# Altium schematic sheet Project_OLIA.SchDoc
size A2; SheetNumber: 1; SheetTotal: 1
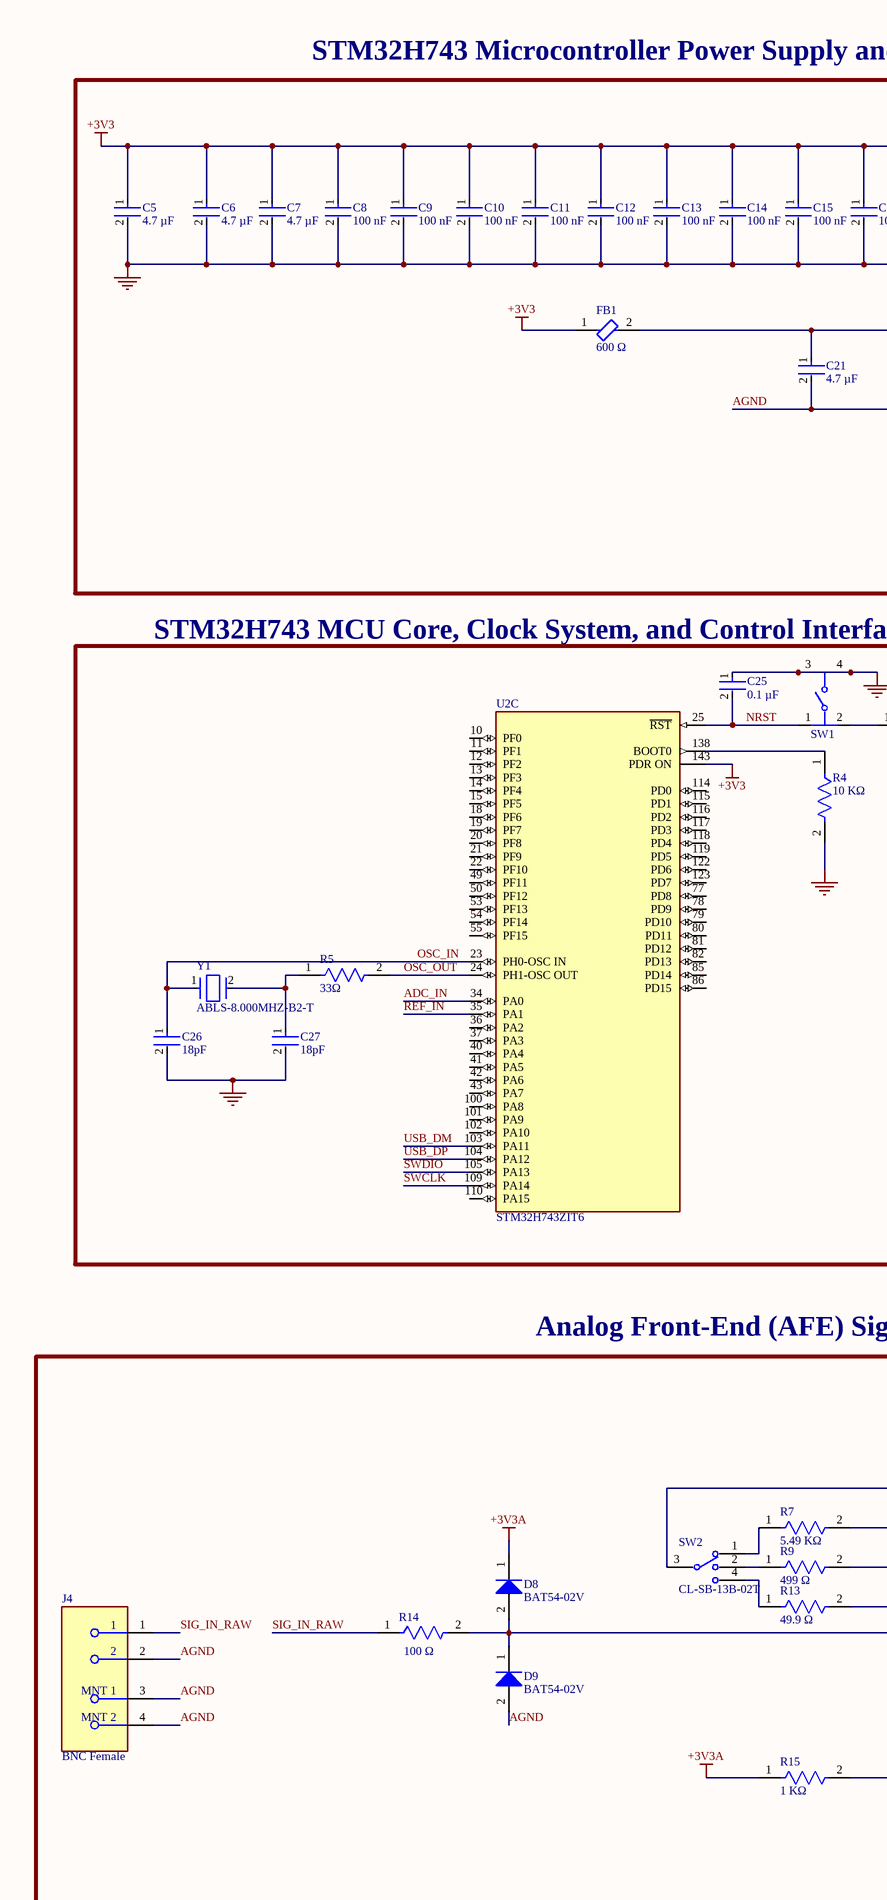
[diagram p0: Project_OLIA.SchDoc, left]
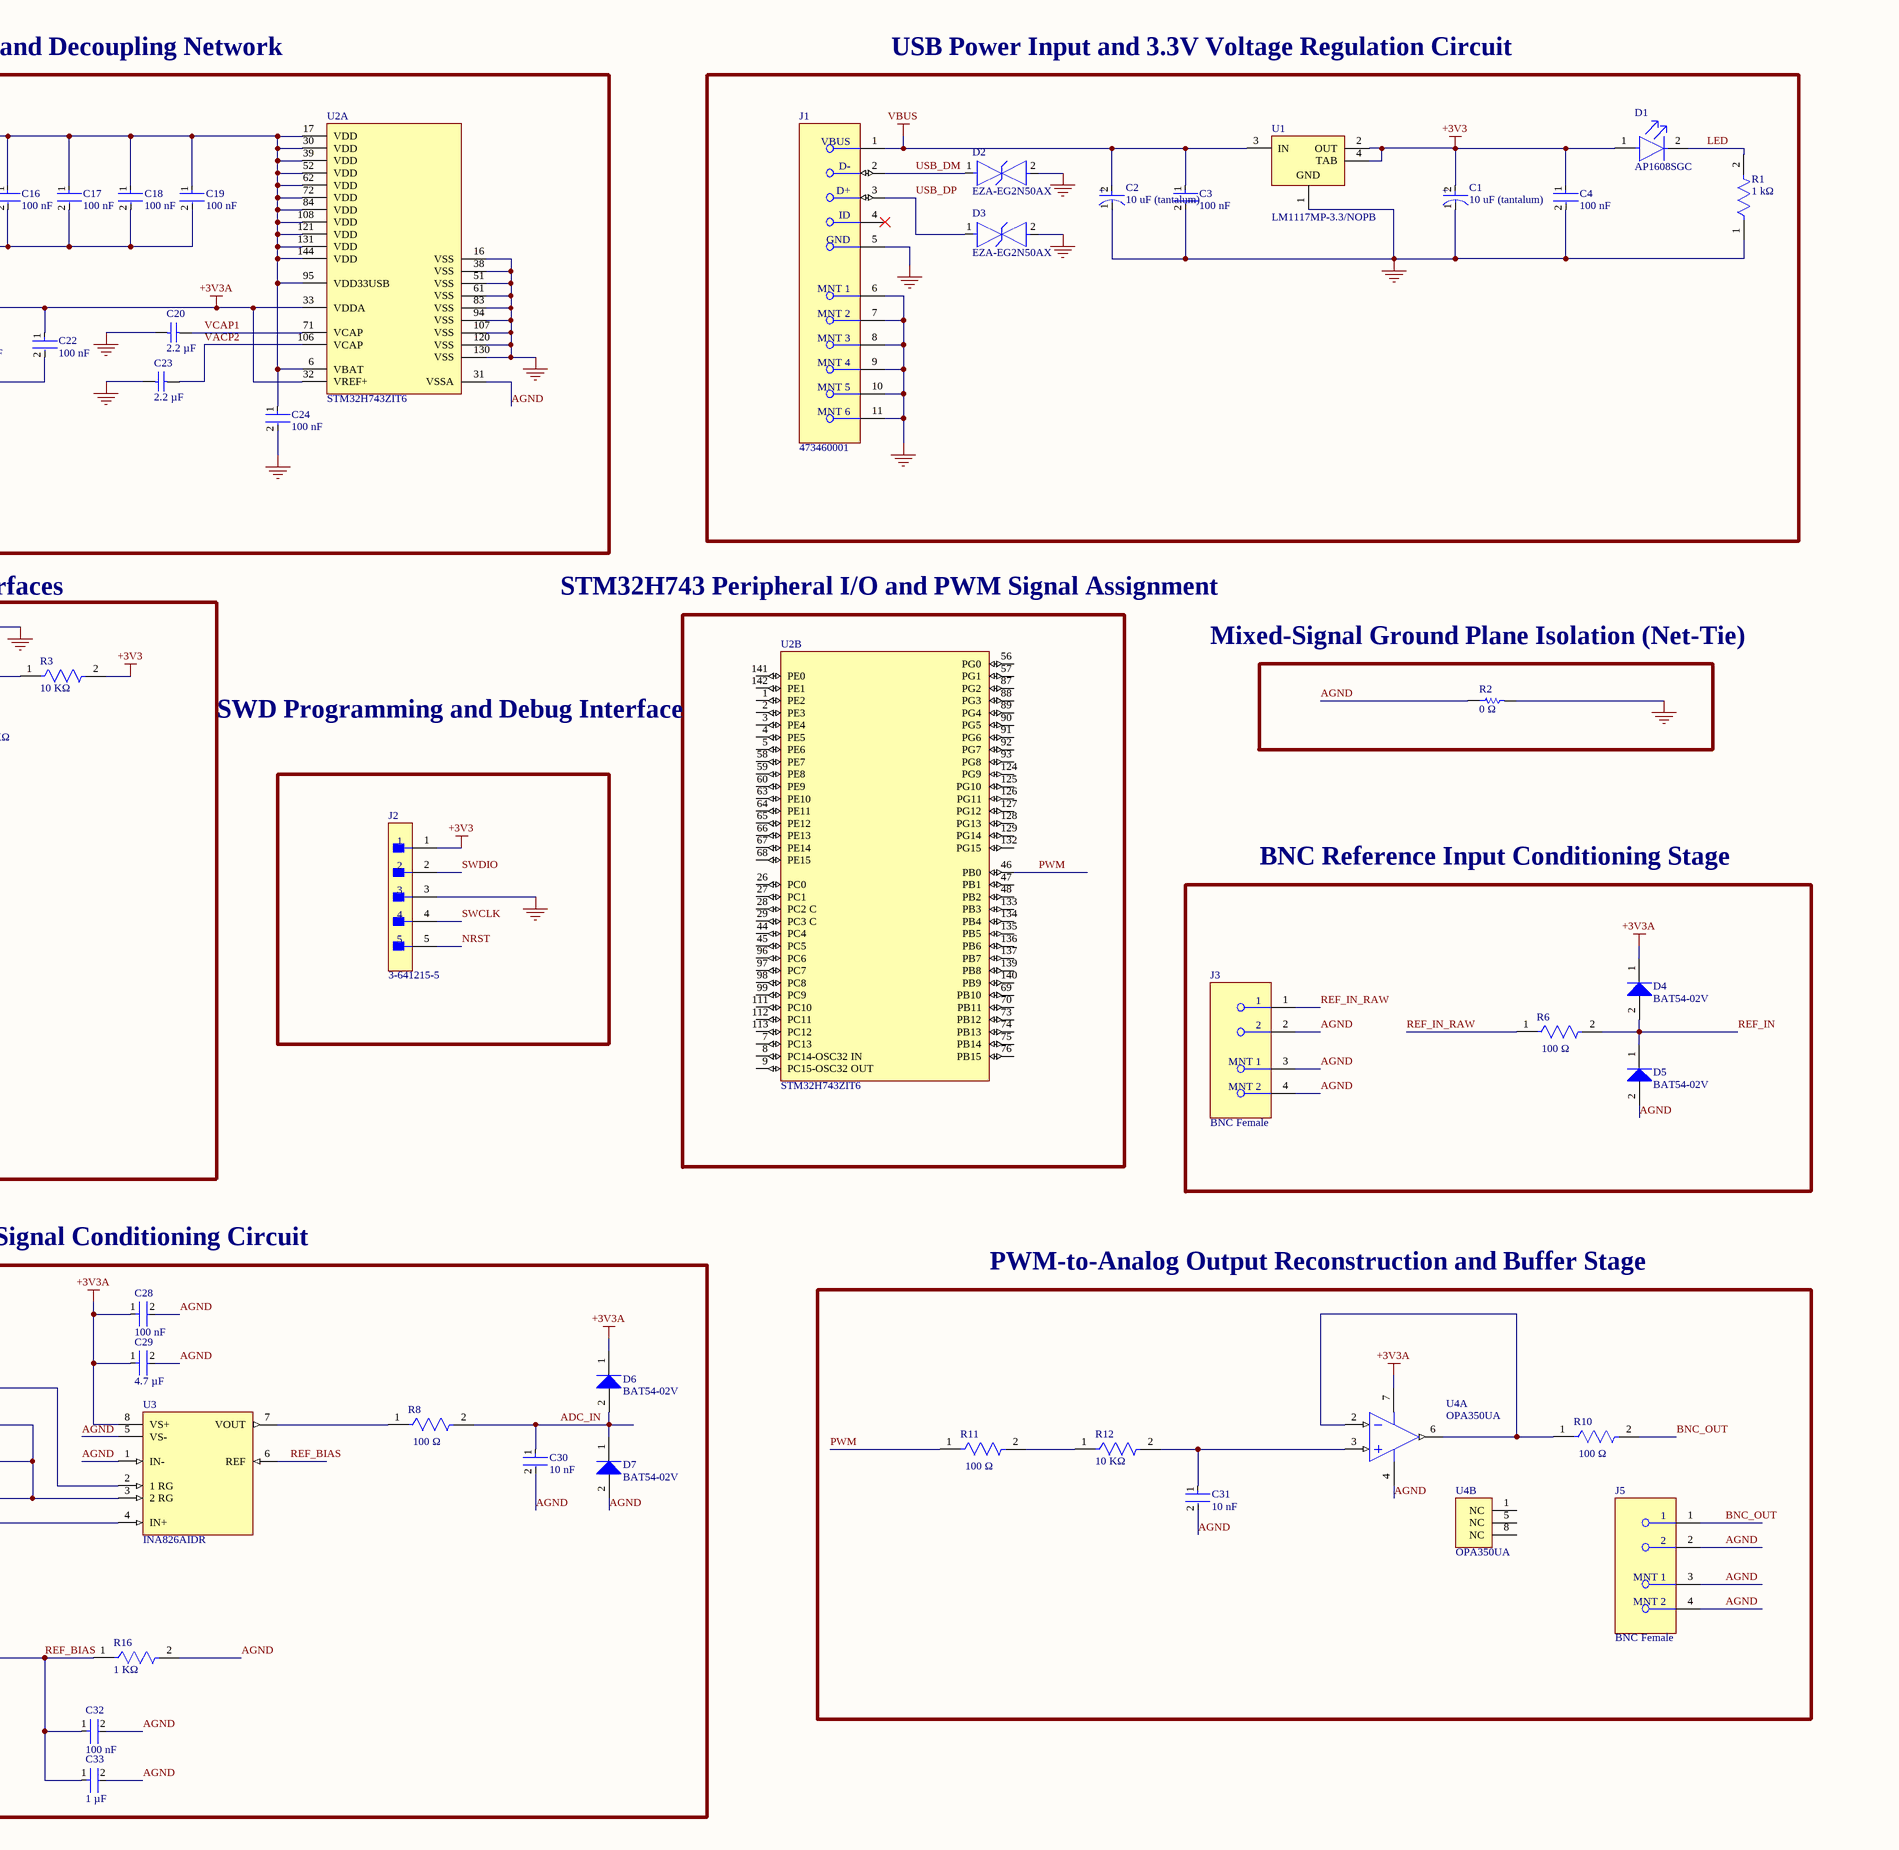
[diagram p1: Project_OLIA.SchDoc, right]

## Parts
C1  10 uF (tantalum)  [FP-T491B106K016AT-MFG]
C2  10 uF (tantalum)  [FP-T491B106K016AT-MFG]
C3  100 nF  [FP-0603B104K500CT-IPC_C]
C4  100 nF  [FP-0603B104K500CT-IPC_C]
C5  4.7 µF  [FP-GCM31C-0_2-e0_3_0_8-IPC_A]
C6  4.7 µF  [FP-GCM31C-0_2-e0_3_0_8-IPC_A]
C7  4.7 µF  [FP-GCM31C-0_2-e0_3_0_8-IPC_A]
C8  100 nF  [FP-0603B104K500CT-IPC_C]
C9  100 nF  [FP-0603B104K500CT-IPC_C]
C10  100 nF  [FP-0603B104K500CT-IPC_C]
C11  100 nF  [FP-0603B104K500CT-IPC_C]
C12  100 nF  [FP-0603B104K500CT-IPC_C]
C13  100 nF  [FP-0603B104K500CT-IPC_C]
C14  100 nF  [FP-0603B104K500CT-IPC_C]
C15  100 nF  [FP-0603B104K500CT-IPC_C]
C16  100 nF  [FP-0603B104K500CT-IPC_C]
C17  100 nF  [FP-0603B104K500CT-IPC_C]
C18  100 nF  [FP-0603B104K500CT-IPC_C]
C19  100 nF  [FP-0603B104K500CT-IPC_C]
C20  2.2 µF  [CAPC0603X33X15ML03T05]
C21  4.7 µF  [FP-GCM31C-0_2-e0_3_0_8-IPC_A]
C22  100 nF  [FP-0603B104K500CT-IPC_C]
C23  2.2 µF  [CAPC0603X33X15ML03T05]
C24  100 nF  [FP-0603B104K500CT-IPC_C]
C25  0.1 µF  [FP-C0603C-CF-MFG]
C26  18pF  [FP-GCM155-0_05-IPC_B]
C27  18pF  [FP-GCM155-0_05-IPC_B]
C28  100 nF  [FP-0603B104K500CT-IPC_C]
C29  4.7 µF  [FP-GCM31C-0_2-e0_3_0_8-IPC_A]
C30  10 nF  [FP-GCM155-0_05-IPC_C]
C31  10 nF  [FP-GCM155-0_05-IPC_C]
C32  100 nF  [FP-0603B104K500CT-IPC_C]
C33  1 µF  [FP-GRM21B-0_2-e0_2_0_7-MFG]
D1  AP1608SGC  [FP-AP1608SGC-MFG]
D2  EZA-EG2N50AX  [FP-EZAEG2N-MFG]
D3  EZA-EG2N50AX  [FP-EZAEG2N-MFG]
D4  BAT54-02V  [INF-SC79_V]
D5  BAT54-02V  [INF-SC79_V]
D6  BAT54-02V  [INF-SC79_V]
D7  BAT54-02V  [INF-SC79_V]
D8  BAT54-02V  [INF-SC79_V]
D9  BAT54-02V  [INF-SC79_V]
FB1  600 Ω  [FP-MMZ1608-0_6-MFG]
J1  473460001  [FP-473460001-MFG]
J2  3-641215-5  [FP-3-641215-5-MFG]
J3  BNC Female  [FP-73137-5003-MFG]
J4  BNC Female  [FP-73137-5003-MFG]
J5  BNC Female  [FP-73137-5003-MFG]
R1  1 kΩ  [FP-RMCF0603-MFG]
R2  0 Ω  [RESC1609X50X30LL10T20]
R3  10 KΩ  [FP-RC1005-IPC_B]
R4  10 KΩ  [FP-RC1005-IPC_B]
R5  33Ω  [FP-CRCW2512-e3-IPC_C]
R6  100 Ω  [FP-ERA1A-IPC_B]
R7  5.49 KΩ  [FP-CRCW0805-e3-IPC_B]
R8  100 Ω  [FP-ERA1A-IPC_B]
R9  499 Ω  [FP-CRCW0603-e3-MFG]
R10  100 Ω  [FP-ERA1A-IPC_B]
R11  100 Ω  [FP-ERA1A-IPC_B]
R12  10 KΩ  [FP-RC1005-IPC_B]
R13  49.9 Ω  [FP-AC2512-MFG]
R14  100 Ω  [FP-ERA1A-IPC_B]
R15  1 KΩ  [FP-RP732B-MFG]
R16  1 KΩ  [FP-RP732B-MFG]
SW1  1-1977223-9  [FP-1-1977223-9-MFG]  (value not drawn)
SW2  CL-SB-13B-02T  [FP-CL-SB-13B-02T-MFG]
U1  LM1117MP-3.3/NOPB  [DCY0004A_L]
U2  STM32H743ZIT6  [FP-LQFP144-1A-MFG]  (parts A,B,C of 3)
U3  INA826AIDR  [FP-D0008A-IPC_A]
U4  OPA350UA  [D0008A_M]  (parts A,B of 2)
Y1  ABLS-8.000MHZ-B2-T  [FP-ABLS-MFG]

## Blocks framed on the sheet
USB Power Input and 3.3V Voltage Regulation Circuit: C1-C4 D1-D3 J1 R1 U1
STM32H743 MCU Core, Clock System, and Control Interfaces: C25-C27 R3-R5 SW1 U2 Y1
BNC Reference Input Conditioning Stage: D4 D5 J3 R6
Analog Front-End (AFE) Signal Conditioning Circuit: C28-C30 C32 C33 D6-D9 J4 R7-R9 R13-R16 SW2 U3
PWM-to-Analog Output Reconstruction and Buffer Stage: C31 J5 R10-R12 U4

## Nets
+3V3: C1.2(A) C4.1 C5.1 C6.1 C7.1 C8.1 C9.1 C10.1 C11.1 C12.1 C13.1 C14.1 C15.1 C16.1 C17.1 C18.1 C19.1 C24.1 D1.1(A) FB1.1 J2.1 R3.2 U1.2(OUT) U1.4(TAB) U2.6(VBAT) U2.17(VDD) U2.30(VDD) U2.39(VDD) U2.52(VDD) U2.62(VDD) U2.72(VDD) U2.84(VDD) U2.95(VDD33USB) U2.108(VDD) U2.121(VDD) U2.131(VDD) U2.143(PDR_ON) U2.144(VDD)
+3V3A: C21.1 C22.1 C28.1 C29.1 D4.1(K) D6.1(K) D8.1(K) FB1.2 R15.1 U2.32(VREF+) U2.33(VDDA) U3.8(VS+) U4.7(V+)
GND: C1.1(C) C2.1(C) C3.2 C4.2 C5.2 C6.2 C7.2 C8.2 C9.2 C10.2 C11.2 C12.2 C13.2 C14.2 C15.2 C16.2 C17.2 C18.2 C19.2 C20.2 C23.1 C24.2 C25.1 C26.2 C27.2 D2.2 D3.2 J1.5(GND) J1.6(MNT_1) J1.7(MNT_2) J1.8(MNT_3) J1.9(MNT_4) J1.10(MNT_5) J1.11(MNT_6) J2.3 R1.1 R2.2 R4.2 SW1.3 SW1.4 U1.1(GND) U2.16(VSS) U2.38(VSS) U2.51(VSS) U2.61(VSS) U2.83(VSS) U2.94(VSS) U2.107(VSS) U2.120(VSS) U2.130(VSS)
VBUS: C2.2(A) C3.1 J1.1(VBUS) U1.3(IN)
ADC_IN: C30.1 D6.2(A) D7.1(K) R8.2 U2.34(PA0)
AGND: C21.2 C22.2 C28.2 C29.2 C30.2 C31.2 C32.2 C33.2 D5.2(A) D7.2(A) D9.2(A) J3.2 J3.3(MNT_1) J3.4(MNT_2) J4.2 J4.3(MNT_1) J4.4(MNT_2) J5.2 J5.3(MNT_1) J5.4(MNT_2) R2.1 R16.2 U2.31(VSSA) U3.1(IN-) U3.5(VS-) U4.4(V-)
BNC_OUT: J5.1 R10.2
LED: D1.2(C) R1.2
NRST: C25.2 J2.5 SW1.1 U2.25(~{RST})
OSC_IN: C26.1 U2.23(PH0-OSC_IN) Y1.1
OSC_OUT: R5.2 U2.24(PH1-OSC_OUT)
PWM: R11.1 U2.46(PB0)
REF_BIAS: C32.1 C33.1 R15.2 R16.1 U3.6(REF)
REF_IN: D4.2(A) D5.1(K) R6.2 U2.35(PA1)
REF_IN_RAW: J3.1 R6.1
SIG_IN_RAW: J4.1 R14.1
SWCLK: J2.4 U2.109(PA14)
SWDIO: J2.2 U2.105(PA13)
USB_DM: D2.1 J1.2(D-) U2.103(PA11)
USB_DP: D3.1 J1.3(D+) U2.104(PA12)
VACP2: C23.2 U2.106(VCAP)
VCAP1: C20.1 U2.71(VCAP)
NetC27_1: C27.1 R5.1 Y1.2
NetC31_1: C31.1 R12.2 U4.3(IN+)
NetD8_2: D8.2(A) D9.1(K) R14.2 U3.4(IN+)
NetR3_1: R3.1 SW1.2
NetR4_1: R4.1 U2.138(BOOT0)
NetR7_1: R7.1 SW2.1
NetR7_2: R7.2 R9.2 R13.2 U3.3(2_RG)
NetR8_1: R8.1 U3.7(VOUT)
NetR9_1: R9.1 SW2.2
NetR10_1: R10.1 U4.2(IN-) U4.6(OUT)
NetR11_2: R11.2 R12.1
NetR13_1: R13.1 SW2.4
NetSW2_3: SW2.3(C) U3.2(1_RG)

Not connected (* = marked no-connect by the designer): J1 4(ID)*; U2 1(PE2) 2(PE3) 3(PE4) 4(PE5) 5(PE6) 7(PC13) 8(PC14-OSC32_IN) 9(PC15-OSC32_OUT) 10(PF0) 11(PF1) 12(PF2) 13(PF3) 14(PF4) 15(PF5) 18(PF6) 19(PF7) 20(PF8) 21(PF9) 22(PF10) 26(PC0) 27(PC1) 28(PC2_C) 29(PC3_C) 36(PA2) 37(PA3) 40(PA4) 41(PA5) 42(PA6) 43(PA7) 44(PC4) 45(PC5) 47(PB1) 48(PB2) 49(PF11) 50(PF12) 53(PF13) 54(PF14) 55(PF15) 56(PG0) 57(PG1) 58(PE7) 59(PE8) 60(PE9) 63(PE10) 64(PE11) 65(PE12) 66(PE13) 67(PE14) 68(PE15) 69(PB10) 70(PB11) 73(PB12) 74(PB13) 75(PB14) 76(PB15) 77(PD8) 78(PD9) 79(PD10) 80(PD11) 81(PD12) 82(PD13) 85(PD14) 86(PD15) 87(PG2) 88(PG3) 89(PG4) 90(PG5) 91(PG6) 92(PG7) 93(PG8) 96(PC6) 97(PC7) 98(PC8) 99(PC9) 100(PA8) 101(PA9) 102(PA10) 110(PA15) 111(PC10) 112(PC11) 113(PC12) 114(PD0) 115(PD1) 116(PD2) 117(PD3) 118(PD4) 119(PD5) 122(PD6) 123(PD7) 124(PG9) 125(PG10) 126(PG11) 127(PG12) 128(PG13) 129(PG14) 132(PG15) 133(PB3) 134(PB4) 135(PB5) 136(PB6) 137(PB7) 139(PB8) 140(PB9) 141(PE0) 142(PE1); U4 1(NC) 5(NC) 8(NC)

## Notes on the sheet
- STM32H743 Microcontroller Power Supply and Decoupling Network
- STM32H743 Peripheral I/O and PWM Signal Assignment
- Mixed-Signal Ground Plane Isolation (Net-Tie)
- SWD Programming and Debug Interface
- (in symbol CMP-03017-000012-1) +

## Library data of the parts
C1 C2 = CMP-03017-000012-1: CAP TANT 10UF 10% 16V 1411; Dissipation Factor: 6%; ESR (Equivalent Series Resistance): 2.8R; Ripple Current: 174mA; Leakage Current: 1.6uA; Polarity: Polar; Life (Hours): 2000Hour; Case/Package: 1411; Height - Seated (Max): 0.083inch; Case Code (Metric): 3528; Height: 1.9mm; Packaging: Tape and Reel; RoHS Compliant: Yes; Voltage Rating (DC): 16V; Tolerance: 10%; Lead Pitch: 1.9mm; Min Operating Temperature: -55°C; Dielectric Material: Tantalum; Package Quantity: 1; Capacitance: 10uF; Mount: Surface Mount; Length: 3.5mm; Max Operating Temperature: 125°C; Number of Pins: 2; Voltage: 16V; Voltage Rating: 16V; Termination: SMD/SMT; Depth: 2.8mm; Lead Free: Lead Free; REACH SVHC: No SVHC; Case Code (Imperial): 1411; Width: 0.11inch; Features: General Purpose
C3 C4 C8-C19 C22 C24 C28 C32 = CMP-45632-000007-1: CAP CER 0.1UF 50V X7R 0603; Tolerance: 10%; Capacitance: 100nF; Radiation Hardening: No; Depth: 0.8mm; Length: 1.6mm; Voltage Rating: 50V; Dielectric: X7R; Case/Package: 0603; RoHS Compliant: Yes; Case Code (Metric): 1608; Voltage Rating (DC): 50V; Min Operating Temperature: -55°C; Series: -; Max Operating Temperature: 125°C; Lead Free: Lead Free; Case Code (Imperial): 0603; Packaging: Tape and Reel
C5-C7 C21 C29 = CMP-06035-005125-1: Ceramic Capacitor for Automotive 4.7uF ±10% 50VDC X7S 1206 Embossed T/R; Voltage Rating (DC): 50V; Tolerance: 10%; Case Code (Imperial): 1206; Mount: Surface Mount; Thickness: 0.071inch; Width: 1.6mm; Case/Package: 1206; Max Operating Temperature: 125°C; Package Quantity: 2000; Height: 1.6mm; Ratings: AEC-Q200; Length: 3.2mm; Termination: SMD/SMT; Packaging: Tape and Reel; Depth: 1.6mm; Case Code (Metric): 3216; Voltage Rating: 50V; Dielectric: X7S; Min Operating Temperature: -55°C; Capacitance: 4.7uF
C20 C23 = CMP-2010-00434-1: Manufacturer: AVX Interconnect / Elco; Part Number: 0201ZD225MAT2A
C25 = CMP-2006-03061-2: CAP CER 0.1UF 50V X7R 0603; Manufacturer: KEMET; Manufacturer Part Number: C0603C104K5RACTU; Tolerance: 0.1; Temperature Coefficient: 30ppm/°C; Material: Ceramic; Automotive Grade: Grade 1; Value: 0.10 μF; Temperature: -55°C to +125°C; RoHS: TRUE; Temperature Range High: +125°C; Lead Free: Yes; Octopart: https://octopart.com/c0603c104k5ractu-kemet-139244; Digikey Description: CAP CER 0.1UF 50V X7R 0603; Category: Cap; Package: C0603C-CF; ComponentLink2Description: Datasheet; Temperature Range Low: -55°C; Device Class L1: Passive Components; Voltage Rating: 50 V; Automotive: Yes; Device Class L3: Ceramic Capacitors; ComponentLink2URL: https://api.kemet.com/component-edge/download/datasheet/C0603C100J5GACAUTO.pdf; Capacitance: 0.10 μF; Device Class L2: Capacitors; Temperature Characteristic: X7R; Height: 0.87mm
C26 C27 = CMP-06035-056816-1: Ceramic Capacitor for Automotive 18pF ±5% 50VDC C0G 0402 Paper T/R; Voltage Rating (DC): 50V; Length: 1mm; Weight: 0.000212oz; Depth: 0.5mm; Termination: SMD/SMT; Capacitance: 18pF; Packaging: Tape and Reel; Mount: Surface Mount; Thickness: 0.022inch; Min Operating Temperature: -55°C; Height: 0.5mm; Width: 0.02inch; Tolerance: 5%; Package Quantity: 10000; Voltage Rating: 50V; Case Code (Metric): 1005; Ratings: AEC-Q200; Dielectric: C0G; Case Code (Imperial): 0402; Max Operating Temperature: 125°C; Case/Package: 0402
C30 C31 = CMP-2008-03715-2: Ceramic Capacitor for Automotive 10nF ±10% 25VDC X7R 0402 Paper T/R; Voltage Rating (DC): 25V; Packaging: Tape and Reel; Case/Package: 0402; Max Operating Temperature: 125°C; Radiation Hardening: No; Case Code (Metric): 1005; Termination: SMD/SMT; Mount: Surface Mount; Voltage: 25V; Width: 0.02inch; Dielectric: X7R; Height: 0.5mm; Depth: 0.5mm; Length: 1mm; Package Quantity: 1; Thickness: 0.022inch; Voltage Rating: 25V; Case Code (Imperial): 0402; Ratings: AEC-Q200; Capacitance: 10nF; REACH SVHC: No SVHC; Lead Free: Lead Free; Min Operating Temperature: -55°C; Tolerance: 10%
C33 = CMP-06035-022504-1: Chip Multilayer Ceramic Capacitors for General Purpose, 0805, 1.0uF, X7S, 22%, 10%, 100V; Capacitance: 1uF; Width: 1.25mm; Dielectric: X7S; Length: 2mm; Thickness: 1.25mm; Voltage Rating (DC): 100V; Tolerance: 10%
D1 = CMP-44529-000023-1: Standard LEDs - SMD GREEN WATER CLEAR; Luminous Intensity: 15mcd; Wavelength: 568nm; Forward Voltage: 2.2V; Forward Current: 20mA; Viewing Angle: 120°; Min Operating Temperature: -40°C; Mount: Surface Mount; Case/Package: 0603; Package Quantity: 2000; Lens Style: Clear; Illumination Color: Green; Packaging: Tape and Reel; Color: Green; Lead Free: Lead Free; Lens Color: Clear; Max Operating Temperature: 85°C
D2 D3 = CMP-00287-77741802-1: EZA-EG2N50AX Esd Suppressor, 50V, 0402 Rohs Compliant: Yes; Direction: Bidirectional; Capacitance: 50fF; Reverse Standoff Voltage: 30V; Case/Package: 0402; Min Operating Temperature: -55°C; Height: 430µm; RoHS: Non-Compliant; Lifecycle Status: Production; Max Operating Temperature: 125°C; Schedule B: 8536300000, 8536300000
D4-D9 = CMP-1182-00001-1: Silicon Schottky Diode, SC79, Reel, Green; Manufacturer: Infineon; Green: TRUE; ComponentLink3Description: Package Specification; ComponentLink2Description: Datasheet; ComponentLink1Description: Manufacturer URL; PackageDescription: 2-Pin Semiconductor Package, 0.8 x 1.2 mm Body; RevisionNote: Re-Activated Devices; PartNumber: BAT54-02V; ComponentLink3URL: http://www.infineon.com/dgdl/SC79-Package_Overview.pdf?folderId=db3a30431936bc4b011951fbddb03b15&fileId=db3a30431936bc4b01195226fe583b41; PackageReference: SC79; ComponentLink1URL: http://www.infineon.com/; ComponentLink2URL: http://www.infineon.com/dgdl/bat54series.pdf?folderId=db3a30431400ef68011425f1ca2505e3&fileId=db3a304314dca3890115190b74210ea6; Mounting Technology: Surface Mount; Halogen-free: FALSE
FB1 = CMP-08257-000287-1: Signal Line Ferrite Bead 600 Ω 100MHz 500mA DCR 400mΩ AEC-Q200 SMD 0603; Impedance: 600R; Number of Lines: 1; DC Resistance (DCR): 400mR; Tolerance: 25%; Package Quantity: 1; RoHS Compliant: Yes; Case/Package: 0603; Width: 0.031inch; Test Frequency: 100MHz; Length: 0.063inch; Weight: 7.1E-05oz; Packaging: Tape and Reel; Max Current Rating: 500mA; Min Operating Temperature: -55°C; Ratings: AEC-Q200; Max Operating Temperature: 125°C; Termination: SMD/SMT; Case Code (Metric): 1608; Mount: Surface Mount; Height: 0.03inch; Case Code (Imperial): 0603; Max DC Current: 500mA
J1 = CMP-2000-05246-2: CONN RCPT USB2.0 MICRO B SMD R/A; Manufacturer: Molex; Conn Orientation: Right Angle; Is Female: yes; Shielding: true; Pitch: 0.65mm; Number Of Contacts: 5; Voltage Rating: 30V; Current Rating: 1.8A; Device Class L2: USB Connectors; Digikey Description: CONN RCPT USB2.0 MICRO B SMD R/A; Height: 2.945mm; RoHS: TRUE; ComponentLink2Description: Datasheet; Octopart: https://octopart.com/47346-0001-molex-7164928; Automotive: No; Package: 0; Category: Conn; Device Class L1: Connectors; Usb Standard: USB 2.0; Temperature: -30°C to +85°C; Temperature Range Low: -30°C; Footprint Url: https://www.molex.com/pdm_docs/sd/473460001_sd.pdf; ComponentLink2URL: https://www.molex.com/webdocs/datasheets/pdf/en-us/0473460001_IO_CONNECTORS.pdf; Lead Free: Yes; Manufacturer Part Number: 473460001; Contact Material: Gold,Nickel; Temperature Range High: +85°C; Device Class L3: unset
J2 = CMP-03369-000062-1: CONN HEADER VERT 5POS 2.54MM; Manufacturer: TE Connectivity; Voltage Rating: 250V; Conn Gender: Male; Conn Orientation: Vertical; Current Rating: 5A; Number Of Contacts: 5; Device Class L3: unset; Package: 3-641215-5; Digikey Description: CONN HEADER VERT 5POS 2.54MM; Device Class L1: Connectors; Temperature: -55°C to +105°C; Manufacturer Part Number: 3-641215-5; Pitch: 2.54mm; RoHS: TRUE; ComponentLink2Description: Datasheet; Footprint Url: https://www.te.com/commerce/DocumentDelivery/DDEController?Action=showdoc&DocId=Customer+Drawing%7F641215%7FZ4%7Fpdf%7FEnglish%7FENG_CD_641215_Z4.pdf%7F3-641215-5; Height: 0.415inch; Temperature Range High: +105°C; Mouser Description: Headers & Wire Housings FRICTION LCK HDR 5P Straight Post gold; Automotive: No; Number Of Rows: 1; Device Class L2: Headers and Wire Housings; Contact Material: Gold,Nickel; Temperature Range Low: -55°C; ComponentLink2URL: https://www.te.com/commerce/DocumentDelivery/DDEController?Action=showdoc&DocId=Specification+Or+Standard%7F108-1050%7FL%7Fpdf%7FEnglish%7FENG_SS_108-1050_L.pdf%7F3-641215-5; Octopart: https://octopart.com/3-641215-5-te+connectivity-40938285; Category: Conn; Lead Free: Yes
J3-J5 = CMP-00257-00776508-1: 73137-5003 Connector BNC Female 0Hz To 2GHz 50 Ohm Solder Right Angle Through Hole Gold Tray; NexarPartId: 776508; Manufacturer Lifecycle Status: ACTIVE; Body Plating: Nickel; Polarity: Normal; Connector Type: PCB; Number of Contacts: 1; Impedance: 50Ω; Body Material: PBT, Polybutylene; Voltage Rating: 500V; Dielectric Material: Polypropylene; Min Operating Temperature: -20°C; Orientation: Right Angle, Straight; Termination: Solder; Gender: Female; RoHS: Compliant; REACH SVHC: No SVHC; Lifecycle Status: Production; Country of Origin: US; Contact Plating: Gold; Depth: 14.76mm; Lead Free: Lead Free; Mount: Through Hole; Length: 35.18mm; Max Operating Temperature: 70°C; Frequency: 2GHz; Radiation Hardening: No; Height: 13.2mm; Plating: Nickel; Contact Material: Bronze, Gold, Nickel, Tin; Insulation Material: Polyester; Halogen Free: Low Halogen
R1 = CMP-26527-000152-1: 1kΩ ±1% 0.1W 0603 Thick Film Chip Resistor AEC-Q200 compliant; Resistance: 1kR; Max Power Dissipation: 100mW; Temperature Coefficient: 100ppm/°C; Packaging: Tape and Reel; Mount: Surface Mount; RoHS Compliant: Yes; Construction: Rectangular; Width: 0.031inch; Case Code (Imperial): 0603; Contact Plating: Tin; Length: 1.55mm; Lead Free: Lead Free; Case Code (Metric): 1608; Size Code: 0603; Depth: 0.8mm; Series: RMCF; Power Rating: 100mW; Height: 0.022inch; Case/Package: 0603; Tolerance: 1%; Min Operating Temperature: -55°C; Military Standard: Not; Features: Automotive AEC-Q200; Max Operating Temperature: 155°C; Number of Terminations: 2; Radiation Hardening: No; Resistor Type: Thick Film
R2 = CMP-1012-00001-2: Manufacturer: Vishay Dale; Part Number: CRCW06030000Z0EC
R3 R4 R12 = CMP-13261-004522-1: Res Thick Film 0402 10kΩ 1% 0.063W ±100ppm/°C Molded SMD T/R; Max Power Dissipation: 63mW; Resistance: 10kR; Power Rating: 62.5mW; Package Quantity: 1; Depth: 0.5mm; Radiation Hardening: No; Features: Moisture Resistant; Max Operating Temperature: 155°C; Case Code (Metric): 1005; Military Standard: Not; Case/Package: 0402; Width: 0.02inch; Contact Plating: Tin; Mount: Surface Mount; Packaging: Tape and Reel; Height: 0.016inch; Case Code (Imperial): 0402; Number of Terminations: 2; Composition: Thick Film; Temperature Coefficient: 100ppm/°C; Min Operating Temperature: -55°C; Tolerance: 1%; Length: 1mm
R5 = CMP-02407-004547-1: RES Thick Film, 33Ω, 5%, 1W, 200ppm/°C, 2512; Voltage Rating: 500V; Resistance: 33R; Depth: 3.15mm; Features: Automotive AEC-Q200; Length: 6.3mm; Height: 0.6mm; Power Rating: 1W; Military Standard: Not; Number of Terminations: 2; Tolerance: 5%; Weight: 0.001429oz; Composition: Thick Film; Max Power Dissipation: 1W; Case/Package: 2512; Contact Plating: Tin; Mount: Surface Mount; Max Operating Temperature: 155°C; Width: 3.15mm; Case Code (Metric): 6432; Temperature Coefficient: 200ppm/°C; Lead Free: Lead Free; Case Code (Imperial): 2512; Termination: SMD/SMT; Packaging: Tape and Reel; Package Quantity: 2000; Min Operating Temperature: -55°C; Voltage Rating (DC): 500V
R6 R8 R10 R11 R14 = CMP-05422-000095-1: RES SMD 100 OHM 0.1% 1/20W 0201; Max Power Dissipation: 50mW; Resistance: 100R; Temperature Coefficient: 25ppm/°C; Lead Free: Lead Free; Width: 0.012inch; Max Operating Temperature: 155°C; Features: Automotive AEC-Q200; Packaging: Tape and Reel; Length: 0.024inch; Number of Terminations: 2; Case Code (Imperial): 0201; Case/Package: 0201; Case Code (Metric): 0603; Tolerance: 0.1%; Min Operating Temperature: -55°C; Height: 0.009inch; Resistor Type: Thin Film
R7 = CMP-2001-04029-2: RES Thick Film, 5.49kΩ, 1%, 0.125W, 100ppm/°C, 0805; Voltage Rating: 150V; Power Rating: 125mW; Resistance: 5.49kR; Number of Terminations: 2; Packaging: Tape and Reel; Case/Package: 0805; Width: 0.049inch; Case Code (Imperial): 0805; Case Code (Metric): 2012; Radiation Hardening: No; Length: 2mm; Depth: 1.25mm; Tolerance: 1%; Features: Automotive AEC-Q200; Weight: 0.000194oz; Max Operating Temperature: 155°C; Termination: SMD/SMT; Composition: Thick Film; Military Standard: Not; Max Power Dissipation: 125mW; Temperature Coefficient: 100ppm/°C; Height: 0.45mm; Min Operating Temperature: -55°C; Contact Plating: Tin; Package Quantity: 10
R9 = CMP-2000-03390-2: RES Thick Film, 499Ω, 1%, 0.1W, 100ppm/°C, 0603; Voltage Rating (DC): 75V; Power Rating: 100mW; Resistance: 499R; Case/Package: 0603; Package Quantity: 5000; Military Standard: Not; Length: 1.55mm; Width: 0.85mm; Number of Terminations: 2; Lead Free: Lead Free; Height: 0.45mm; Weight: 7.1E-05oz; Composition: Thick Film; Radiation Hardening: No; Max Operating Temperature: 155°C; Tolerance: 1%; Working Voltage: 75V; Temperature Coefficient: 100ppm/°C; Packaging: Tape and Reel; Contact Plating: Tin; Termination: SMD/SMT; Depth: 0.85mm; Case Code (Metric): 1608; Min Operating Temperature: -55°C; Mount: Surface Mount; Case Code (Imperial): 0603; Voltage Rating: 75V
R13 = CMP-03412-029457-1: RES SMD 49.9 OHM 1% 1W 2512; Manufacturer: Yageo; Manufacturer Part Number: AC2512FK-0749R9L; Automotive Grade: Grade 0; Voltage Rating: 200V; Resistance: 49.9Ω; Tolerance: 0.01; Value: 49.9Ω; Category: Res; Power Rating: 1W; ComponentLink2Description: Datasheet; Device Class L2: Resistors; ComponentLink2URL: http://www.yageo.com/documents/recent/PYu-AC_51_RoHS_L_6.pdf; Footprint Url: http://www.yageo.com/exep/pages/download/literatures/PYu-R_Mount_10.pdf; Lead Free: Yes; Ipc Land Pattern Name: RESC635310X55; Automotive: Yes; Device Class L3: Chip SMD Resistors; Composition: Thick Film; Series: AC; Temperature: -55°C to +155°C; Temperature Range Low: -55°C; Octopart: https://octopart.com/ac2512fk-0749r9l-yageo-71370116; Package: AC2512; RoHS: TRUE; Digikey Description: RES SMD 49.9 OHM 1% 1W 2512; Device Class L1: Passive Components; Height: 0.65mm; Temperature Range High: +155°C
R15 R16 = CMP-03211-010976-1: Res Thin Film 1206 1.0KΩ 0.1% 0.25W 15ppm/°C Molded SMD; Manufacturer: TE Connectivity; Manufacturer Part Number: RP73D2B1K0BTDF; Voltage Rating: 200V; Lead Free: Yes; RoHS: TRUE; Category: Res; Tolerance: 0.1%; Octopart: https://octopart.com/rp73d2b1k0btdf-te+connectivity-22741139; packaging: 1000 Reel; Device Class L2: Resistors; Power Rating: 0.25W; Value: 1.0KΩ; Device Class L1: Passive Components; Device Class L3: Chip SMD Resistors; Temperature Range Low: -55°C; Package: RP732B; Series: RP73; Height: 0.65mm; Composition: Thin Film; Temperature Range High: 155°C; Automotive: No; Temperature Coefficient: 15ppm/°C; octopart_url: https://octopart.com/rp73d2b1k0btdf-te+connectivity-22741139; Temperature: -55°C to 155°C; Ipc Land Pattern Name: RESC305155X55; ComponentLink2Description: Datasheet; Resistance: 1.0KΩ; ComponentLink2URL: https://www.te.com/commerce/DocumentDelivery/DDEController?Action=showdoc&DocId=Data+Sheet%7F1773272%7FL%7Fpdf%7FEnglish%7FENG_DS_1773272_L.pdf%7F8-1879255-6
SW1 = CMP-03407-000015-1: SWITCH TACTILE SPST-NO 0.05A 24V; Current Rating: 50mA; Operating Force: 2.55N; Throw Configuration: SPST; Actuator Material: Nylon; Actuator Color: Pink; Mechanical Life: 1000000Cycles; Illumination Type: Non-Illuminated; Switch Travel: 0.25mm; Switch Function: Off-Mom; Actuator Type: Standard; RoHS Compliant: Yes; Min Operating Temperature: -40°C; Contact Plating: Silver; Max Operating Temperature: 105°C; Contact Material: Stainless Steel; Max Current Rating: 50mA; Series: FSMJSMA; Length: 6mm; Radiation Hardening: No; Depth: 10mm; Max Voltage Rating (DC): 24V; Orientation: Straight; Termination: Gull Wing; Voltage Rating (DC): 24V; Packaging: Bulk; Mount: Surface Mount; Case/Package: SMD/SMT; Package Quantity: 750
SW2 = CMP-08360-77011255-1: CL-SB-13B-02T Switch Slide ON-ON-ON SP3T Top 200mA 12VDC 10000Cycles Gullwing T/R; Actuator Length: 2mm; Contact Style: Non-Shorting; Electrical Life: 10kcycles; Contact Resistance: 70mΩ; Voltage Rating (DC): 12V; Actuator Material: Nylon, Polyamide; RoHS: Compliant; Contact Current Rating: 200mA; Packaging: Tape & Reel (TR); Termination: Gull Wing; Orientation: Vertical; Lead Free: Lead Free; Current Rating: 200mA; Mount: Surface Mount; Height: 6.1mm; Switch Travel: 2mm; Switch Function: On-On-On; Contact Plating: Gold; Min Operating Temperature: -40°C; Throw Configuration: SP3T; Life (Cycles): 10kcycles; NexarPartId: 77011255; Contact Material: Copper; Max Operating Temperature: 85°C
U1 = CMP-0062-01638-4: 800mA Low-Dropout Linear Regulator, 4-pin SOT-223, Pb-Free; Manufacturer: Texas Instruments; CompType: LDO IC; PackageTopMarking: XYTT*N05A; High-Reliability: Y; PowerWise: N; ComponentLink1URL: http://www.ti.com/general/docs/lit/getliterature.tsp?genericPartNumber=LM1117-N&fileType=pdf; PinCount: 4; PackageDescription: Molded SOT-223, 6.50 x 3.56 x 1.6mm Body, 4 Lead, 2.3mm Pitch; Code_IPC: SOT223-4; PartNumber: LM1117MP-3.3/NOPB; Code_JEDEC: TO-261-AA; RoHS: Y; PackageReference: DCY0004A; ComponentLink1Description: Datasheet URL
U2 = CMP-12105-000003-1: IC MCU 32BIT 2MB FLASH 144LQFP; Manufacturer: STMicroelectronics; Number Of I2C Channels: 4; Number Of A/D Converters: 2; Standoff Height: 0.05mm; Interface: I2C,SPI,UART,USART,EBI/EMI,CAN,USB,LIN,IrDA,Other; Max Supply Voltage: 3.6V; Number Of Adc Channels: 36; Ram Size: 1MBytes; Number Of Cores: 1; Frequency: 400MHz; Data Bus Width: 32bits; Core Architecture: ARM Cortex-M7; Memory Size: 2MBytes; Number Of Timers/Counters: 22; Min Supply Voltage: 1.62V; Number Of Spi Channels: 6; Max Junction Temp: +125°C; Number Of I/Os: 114; Digikey Description: IC MCU 32BIT 2MB FLASH 144LQFP; Device Class L2: Embedded Processors and Controllers; Number Of Usb Channels: 2; ComponentLink2Description: Datasheet; Ipc Land Pattern Name: QFP50P2200X2200X160-144; Category: IC; Lead Free: Yes; Temperature Range High: +85°C; Mouser Description: MCU 32-Bit STM32 ARM Cortex M7 RISC 2MB Flash 1.8V/2.5V/3.3V 144-Pin LQFP Tray; RoHS: TRUE; Ambient Temperature Range Low: -40°C; Temperature Range Low: -40°C; ComponentLink2URL: https://www.st.com/resource/en/datasheet/stm32h743zi.pdf; Ambient Temperature Range High: +85°C; Octopart: https://octopart.com/stm32h743zit6-stmicroelectronics-76372529; Number Of Pwm Channels: 2; Height: 1.6mm; Manufacturer Part Number: STM32H743ZIT6; Device Class L3: Microcontrollers; Device Class L1: Integrated Circuits (ICs); Automotive: No; Memory Type: FLASH; Number Of Uart Channels: 4; Package: LQFP144-1A; Temperature: -40°C to +85°C
U3 = CMP-0944-00042-3: IC INST AMP 1 CIRCUIT 8SOIC; Number of Circuits: 1; Common Mode Rejection Ratio: 84dB; Power Supply Rejection Ratio (PSRR): 100dB; Input Voltage Noise Density: 18nV/sqrt Hz; Input Resistance: 100kR; Output Current per Channel: 16mA; Input Offset Voltage (Vos): 150uV; Bandwidth: 1MHz; Supply Current: 200uA; Input Bias Current: 65nA; Max Dual Supply Voltage: 18V; Max Supply Voltage: 36V; Min Supply Voltage: 2.7V; Voltage Gain: 60dB; Slew Rate: 1V/µs; Min Dual Supply Voltage: 1.35V; Number of Elements: 1; Series: -; Number of Pins: 8; Lead Free: Lead Free; Output Current: 16mA; REACH SVHC: No SVHC; Min Operating Temperature: -40°C; Quiescent Current: 200uA; Nominal Supply Current: 200uA; Max Operating Temperature: 125°C; RoHS Compliant: Yes; Case/Package: D; -3db Bandwidth: 1MHz; Radiation Hardening: No; Operating Supply Current: 200uA; Packaging: Tape and Reel; Package Quantity: 1; Number of Amplifiers: 1; Number of Channels: 1
U4 = CMP-0271-00145-3: High-Speed, Single-Supply, Rail-to-Rail Operational Amplifier MicroAmplifier(TM) Series, 2.7 to 5.5 V, -40 to 85 degC, 8-pin SOIC (D8), Green (RoHS & no Sb/Br); Manufacturer: Texas Instruments; IIB(Max)(pA): 10; Iq per channel(Max)(mA): 8.5; Number of Channels: 1; CMRR(Min)(dB): 66; Slew Rate(Typ)(V/us): 22; Total Supply Voltage(Max)(+5V is 5, +/-5V is 10): 5.5; Sub Family: Low Input Bias Current Amp (<=10pA), Low Offset Voltage Amplifier (<=500uV), Low Supply Voltage Amplifier (<=2.7V), Precision Amplifier; Offset Drift(Typ)(uV/C): 4; Total Supply Voltage(Min)(+5V is 5, +/-5V is 10): 2.7; Vn at 1kHz(Typ)(nV/rtHz): 18; PackageReference: D0008A; PackageDescription: 8-Pin Plastic Small Outline, Body 4.9 x 3.9 mm, Pitch 1.27 mm; Code_JEDEC: MS-012; Eco-Plan: Green (RoHS & no Sb/Br); DatasheetVersion: SBOS099C; Vio (25C)(Max)(mV): 1; ComponentLink1URL: http://www.ti.com/; ComponentLink3URL: http://www.ti.com/litv/pdf/msoi002j; PackageVersion: 4040047-3/M, 06/2011; ComponentLink3Description: Package Specification; ComponentLink2URL: http://www.ti.com/general/docs/lit/getliterature.tsp?genericPartNumber=OPA350&fileType=pdf; PartNumber: OPA350UA; ComponentLink2Description: Datasheet; ComponentLink1Description: Manufacturer URL; Mounting Technology: Surface Mount
Y1 = CMP-27762-009874-1: CRYSTAL 8.0000MHZ 18PF SMD; ESR (Equivalent Series Resistance): 80R; Operating Frequency: 8 MHz; Frequency Stability: 50ppm; Tolerance: 20ppm; Frequency: 8MHz; Min Operating Temperature: -20°C; Lead Free: Lead Free; Width: 4.7mm; Packaging: Tape and Reel; Series: ABLS; Accuracy: 20ppm; Length: 11.4mm; Frequency Tolerance: 20ppm; Termination: SMD/SMT; Number of Pins: 2; Radiation Hardening: No; Depth: 4.7mm; REACH SVHC: No SVHC; Contact Plating: Tin; Load Capacitance: 18pF; Case/Package: SMD/SMT; Mount: Surface Mount; Package Quantity: 1000; Max Operating Temperature: 70°C; Height: 0.165inch; Series Resistance: 80R